# Altium project USB-C Power.PrjPcb (part 2 of 2)
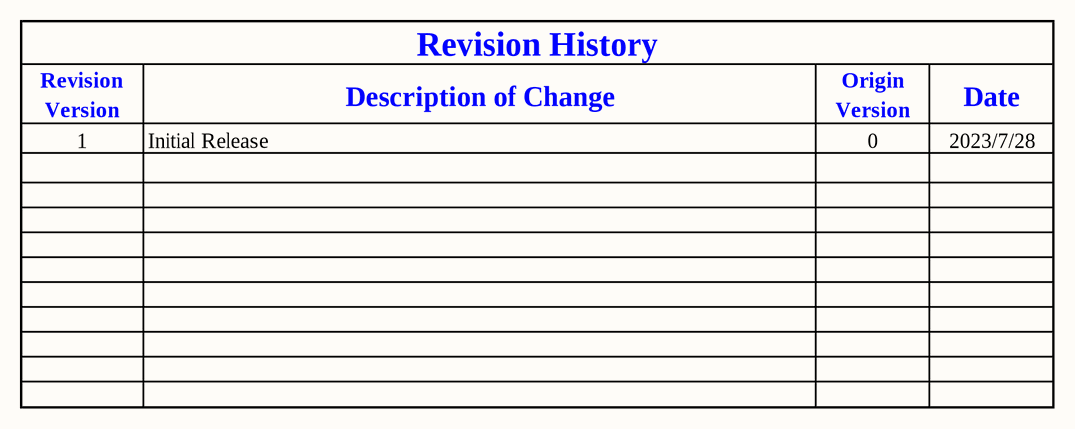
[diagram p9: Revision_History.SchDoc]

## Nets that join several sheets
BCR_3V3: PD_Controll_and_LEDs (6 pins), PD_BCR_Connections (8 pins)
BCR_GND: MCU_and_Peripheral_Circuits (J?#5.1), Type-C_Connector_and_PD_Switch (J?#8.1), PD_BCR_Connections (13 pins)
BQ_3V3: Battery_and_Bypass_Controller_Connectons (5 pins), Battery_Charging_and_Bypass_Power_Supply (C?#58.1 C?#59.1 L?#4.2 R?#55.2)
BQ_CS_VBUS: Battery_and_Bypass_Controller_Connectons (R?#43.2 R?#47.1), Battery_Charging_and_Bypass_Power_Supply (C?#61.2 C?#62.2 J?#11.3 Q?#9.1)
BQ_GND: MCU_and_Peripheral_Circuits (J?#6.2), Battery_and_Bypass_Controller_Connectons (7 pins), Battery_Charging_and_Bypass_Power_Supply (12 pins)
BQ_SB_VBUS: Battery_and_Bypass_Controller_Connectons (10 pins), Battery_Charging_and_Bypass_Power_Supply (J?#12.2)
PD_VBUS_IN: MCU_and_Peripheral_Circuits (C?#2.1 C?#3.1 R?#17.2 REG?#1.6), Type-C_Connector_and_PD_Switch (9 pins), PD_BCR_Connections (U?#2.11), Battery_and_Bypass_Controller_Connectons (PD_VBUS_IN.1 Q?#4.1 R?#34.2 R?#35.2), Battery_Charging_and_Bypass_Power_Supply (D?#13.1 J?#12.1 R?#58.2)
RETURN_GND: Type-C_Connector_and_PD_Switch (7 pins), PD_BCR_Connections (U?#2.19)
TYPE-C_GND: MCU_and_Peripheral_Circuits (9 pins), Type-C_Connector_and_PD_Switch (17 pins), Battery_and_Bypass_Controller_Connectons (32 pins), Battery_Charging_and_Bypass_Power_Supply (18 pins)
USB_VBUS_IN: PD_Controll_and_LEDs (D?#1.1), PD_BCR_Connections (R?#30.1)
~{BQ_BATRV}: Battery_and_Bypass_Controller_Connectons (U?#3.21), Battery_Charging_and_Bypass_Power_Supply (Q?#13.4)
BQ_BTST1: Battery_and_Bypass_Controller_Connectons (U?#3.30), Battery_Charging_and_Bypass_Power_Supply (C?#63.1)
BQ_BTST2: Battery_and_Bypass_Controller_Connectons (U?#3.25), Battery_Charging_and_Bypass_Power_Supply (C?#64.1)
BQ_CELL: Battery_and_Bypass_Controller_Connectons (U?#3.18), Battery_Charging_and_Bypass_Power_Supply (J?#14.1 R?#61.1 R?#62.2)
BQ_HIDRV1: Battery_and_Bypass_Controller_Connectons (U?#3.31), Battery_Charging_and_Bypass_Power_Supply (Q?#9.2)
BQ_HIDRV2: Battery_and_Bypass_Controller_Connectons (U?#3.24), Battery_Charging_and_Bypass_Power_Supply (Q?#12.2)
BQ_IADPT: Battery_and_Bypass_Controller_Connectons (U?#3.8), Battery_Charging_and_Bypass_Power_Supply (J?#16.1)
BQ_IBAT: Battery_and_Bypass_Controller_Connectons (U?#3.9), Battery_Charging_and_Bypass_Power_Supply (J?#18.1)
BQ_LODRV1: Battery_and_Bypass_Controller_Connectons (U?#3.29), Battery_Charging_and_Bypass_Power_Supply (C?#66.1 Q?#10.2)
BQ_LODRV2: Battery_and_Bypass_Controller_Connectons (U?#3.26), Battery_Charging_and_Bypass_Power_Supply (C?#67.2 Q?#11.2)
BQ_PSYS: Battery_and_Bypass_Controller_Connectons (U?#3.10), Battery_Charging_and_Bypass_Power_Supply (J?#20.1)
BQ_REGN: Battery_and_Bypass_Controller_Connectons (U?#3.28), Battery_Charging_and_Bypass_Power_Supply (R?#53.1)
BQ_SCL: Battery_and_Bypass_Controller_Connectons (R?#37.2 U?#3.13), Battery_Charging_and_Bypass_Power_Supply (J?#15.2)
BQ_SDA: Battery_and_Bypass_Controller_Connectons (R?#36.1 U?#3.12), Battery_Charging_and_Bypass_Power_Supply (J?#13.2)
BQ_SW1: Battery_and_Bypass_Controller_Connectons (U?#3.32), Battery_Charging_and_Bypass_Power_Supply (C?#63.2 L?#5.1 Q?#9.3 Q?#10.1)
BQ_SW2: Battery_and_Bypass_Controller_Connectons (U?#3.23), Battery_Charging_and_Bypass_Power_Supply (C?#64.2 L?#5.2 Q?#11.1 Q?#12.3)
BQ_VBATMOS: Battery_and_Bypass_Controller_Connectons (R?#44.1 R?#48.1), Battery_Charging_and_Bypass_Power_Supply (C?#69.1 Q?#13.1 Q?#13.2 Q?#13.3)
BQ_VBUS: Battery_and_Bypass_Controller_Connectons (U?#3.1), Battery_Charging_and_Bypass_Power_Supply (J?#11.2)
CC1: Type-C_Connector_and_PD_Switch (D?#10.1 J?#7.A5), PD_BCR_Connections (C?#23.1 U?#2.15)
CC2: Type-C_Connector_and_PD_Switch (D?#11.1 J?#7.B5), PD_BCR_Connections (C?#24.1 U?#2.14)
CHARGING_MODE: PD_Controll_and_LEDs (J?#4.2), PD_BCR_Connections (U?#2.9)
CHRG_OK: Battery_and_Bypass_Controller_Connectons (CHRG_OK#1.1 Q?#7.2 R?#38.2 U?#3.5), Battery_Charging_and_Bypass_Power_Supply (CHRG_OK#2.1 P?#6.2)
D+: Type-C_Connector_and_PD_Switch (D?#7.1 J?#7.A6 J?#7.B6), PD_BCR_Connections (DP.1 U?#2.5)
D-: Type-C_Connector_and_PD_Switch (D?#8.2 J?#7.A7 J?#7.B7), PD_BCR_Connections (DM.1 U?#2.6)
EN_OTG: Battery_and_Bypass_Controller_Connectons (U?#3.4), Battery_Charging_and_Bypass_Power_Supply (EN_OTG.1 P?#6.3)
FAULT: PD_Controll_and_LEDs (Q?#1.2 R?#5.1), PD_BCR_Connections (FAULT.1 U?#2.8)
HPI_SCL: PD_Controll_and_LEDs (J?#3.2), PD_BCR_Connections (R?#32.1 U?#2.13)
HPI_SDA: PD_Controll_and_LEDs (J?#1.2), PD_BCR_Connections (R?#31.1 U?#2.12)
I2C2_SCL: PD_Controll_and_LEDs (J?#3.1), MCU_and_Peripheral_Circuits (R?#24.1 U?#1.16), Battery_Charging_and_Bypass_Power_Supply (J?#15.1)
I2C2_SDA: PD_Controll_and_LEDs (J?#1.1), MCU_and_Peripheral_Circuits (R?#23.1 U?#1.17), Battery_Charging_and_Bypass_Power_Supply (J?#13.1)
ISNK_COAFRSE: PD_Controll_and_LEDs (ISNk_COAFRSE.1 R?#12.2 R?#14.2), PD_BCR_Connections (U?#2.17)
ISNK_FINE: PD_Controll_and_LEDs (ISNk_FINE.1 R?#13.2 R?#15.2), PD_BCR_Connections (U?#2.16)
QB_ILIM_HIZ: Battery_and_Bypass_Controller_Connectons (U?#3.6), Battery_Charging_and_Bypass_Power_Supply (C?#60.2 D?#16.1 R?#54.1 R?#56.1)
SWD_CLK: PD_Controll_and_LEDs (J?#2.2), PD_BCR_Connections (P?#3.4 U?#2.10)
VBAT: Battery_and_Bypass_Controller_Connectons (10 pins), Battery_Charging_and_Bypass_Power_Supply (D?#14.1)
VBUS_CTRL: Type-C_Connector_and_PD_Switch (R?#27.1), PD_BCR_Connections (U?#2.3)
VBUS_MAX: PD_Controll_and_LEDs (5 pins), PD_BCR_Connections (U?#2.2)
VBUS_MIN: PD_Controll_and_LEDs (R?#9.2 R?#10.2 VBUS_MIN.1), PD_BCR_Connections (U?#2.1)
VDDA: Battery_and_Bypass_Controller_Connectons (U?#3.7), Battery_Charging_and_Bypass_Power_Supply (5 pins)
VSYS: Battery_and_Bypass_Controller_Connectons (9 pins), Battery_Charging_and_Bypass_Power_Supply (5 pins)

## Assembly variants
Start All: not fitted C? C? D? D? D? D? D? P? R? R? R? R? R? R? R? R?